# EAGLE design AntennaPCB EXTV1 (EAGLE 9.1.3)
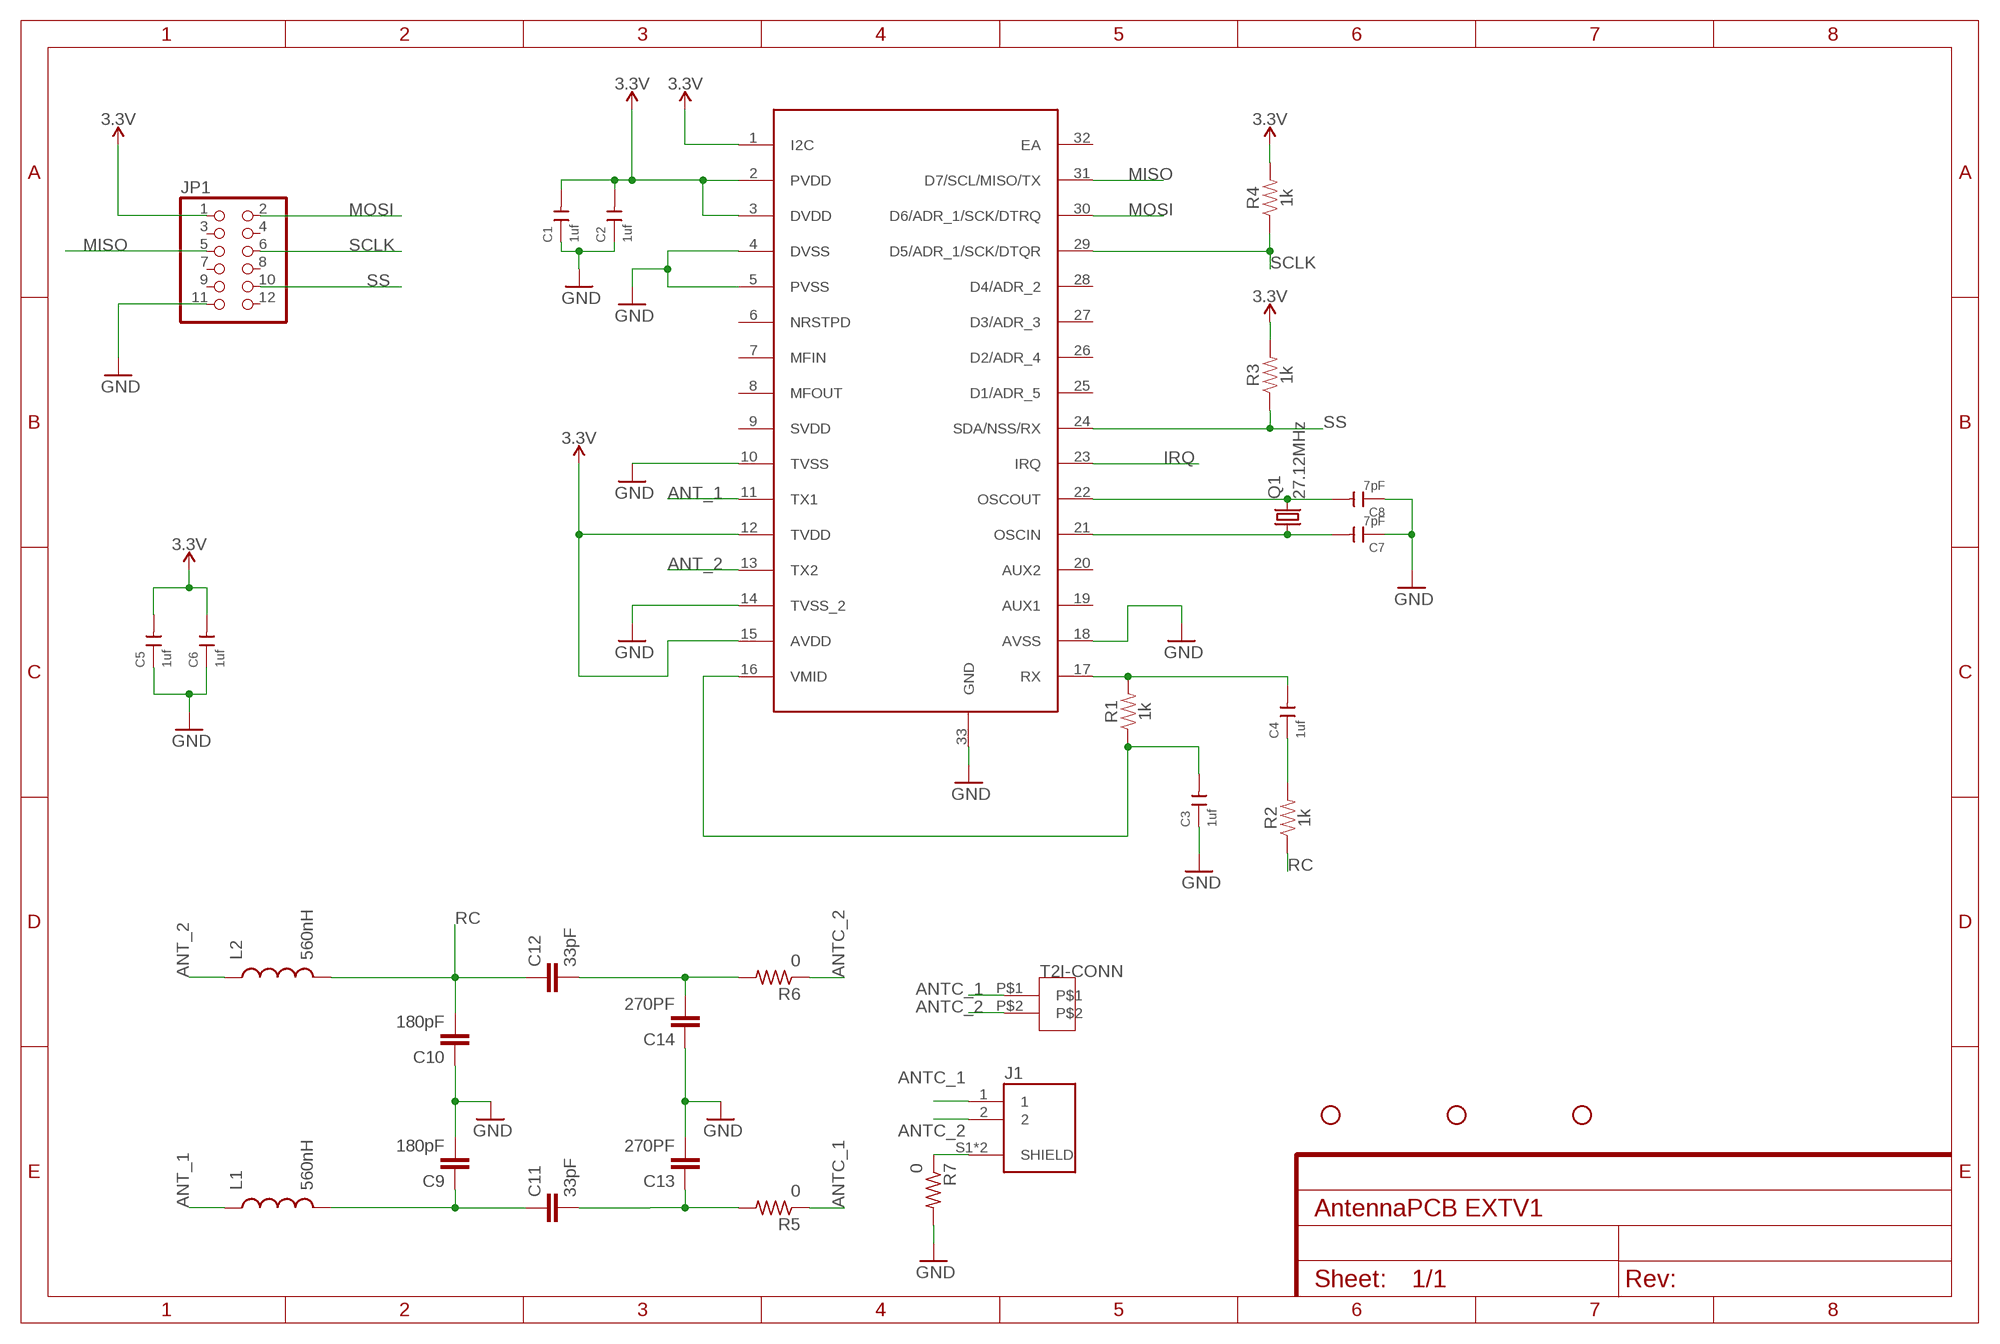
[diagram p0: schematic, sheet 1]
FRAME1 (FRAME-A4L): SPICEPREFIX: X

## Parts
C1  1uf  CERAMIC-1UF-25V-10%-X7R(0603)  [C0603]
C2  1uf  CERAMIC-1UF-25V-10%-X7R(0603)  [C0603]
C3  1uf  CERAMIC-1UF-25V-10%-X7R(0603)  [C0603]
C4  1uf  CERAMIC-1UF-25V-10%-X7R(0603)  [C0603]
C5  1uf  CERAMIC-1UF-25V-10%-X7R(0603)  [C0603]
C6  1uf  CERAMIC-1UF-25V-10%-X7R(0603)  [C0603]
C7  7pF  CERAMIC-1UF-25V-10%-X7R(0603)  [C0603]
C8  7pF  CERAMIC-1UF-25V-10%-X7R(0603)  [C0603]
C9  180pF  180PF-0603-50V-5%  [0603]
C10  180pF  180PF-0603-50V-5%  [0603]
C11  33pF  33PF-0603-50V-5%  [0603]
C12  33pF  33PF-0603-50V-5%  [0603]
C13  270PF  270PF-0603-50V-5%  [0603]
C14  270PF  270PF-0603-50V-5%  [0603]
H1  STAND-OFF  [STAND-OFF]
H2  STAND-OFF  [STAND-OFF]
H3  STAND-OFF  [STAND-OFF]
J1  BM02B-ACHSS-GAN-TF(LF)(SN)  [JST_BM02B-ACHSS-GAN-TF(LF)(SN)]
JP1  PINHD-2X6  [2X06]
L1  560nH  INDUCTOR  [L0603]
L2  560nH  INDUCTOR  [L0603]
Q1  27.12MHz  CRYSTALHC49S  [HC49/S]
R1  1k  1KOHM-0603-1/10W-1%  [0603]
R2  1k  1KOHM-0603-1/10W-1%  [0603]
R3  1k  1KOHM-0603-1/10W-1%  [0603]
R4  1k  1KOHM-0603-1/10W-1%  [0603]
R5  0  ERJ-8GEY0R00V  [RES_1206]
R6  0  ERJ-8GEY0R00V  [RES_1206]
R7  0  ERJ-8GEY0R00V  [RES_1206]
U$1  MFRC522  [HVQFN32]
U$2  T2I-02  [T2I-02]

## Nets
3.3V: C1.2 C2.2 C5.2 C6.2 JP1.1 R3.2 R4.2 U$1.1(I2C) U$1.2(PVDD) U$1.3(DVDD) U$1.12(TVDD) U$1.15(AVDD)
ANT_1: L1.1 U$1.11(TX1)
ANT_2: L2.1 U$1.13(TX2)
ANTC_1: J1.1 R5.1 U$2.P$1
ANTC_2: J1.2 R6.1 U$2.P$2
GND: C1.1 C2.1 C3.1 C5.1 C6.1 C7.1 C8.1 C9.2 C10.1 C13.2 C14.1 JP1.11 R7.2 U$1.4(DVSS) U$1.5(PVSS) U$1.10(TVSS) U$1.14(TVSS_2) U$1.18(AVSS) U$1.33(GND)
IRQ: U$1.23(IRQ)
MISO: JP1.5 U$1.31(D7/SCL/MISO/TX)
MOSI: JP1.2 U$1.30(D6/ADR_1/SCK/DTRQ)
N$1: C3.2 R1.1 U$1.16(VMID)
N$2: C4.2 R1.2 U$1.17(RX)
N$3: C4.1 R2.2
N$5: C8.2 Q1.2 U$1.22(OSCOUT)
N$6: C7.2 Q1.1 U$1.21(OSCIN)
N$7: J1.S1(SHIELD) J1.S2(SHIELD) R7.1
N$9: C9.1 C11.1 L1.2
N$10: C11.2 C13.1 R5.2
N$11: C12.2 C14.2 R6.2
RC: C10.2 C12.1 L2.2 R2.1
SCLK: JP1.6 R4.1 U$1.29(D5/ADR_1/SCK/DTQR)
SS: JP1.10 R3.1 U$1.24(SDA/NSS/RX)
Unconnected: JP1.3 JP1.4 JP1.7 JP1.8 JP1.9 JP1.12 U$1.6(NRSTPD) U$1.7(MFIN) U$1.8(MFOUT) U$1.9(SVDD) U$1.19(AUX1) U$1.20(AUX2) U$1.25(D1/ADR_5) U$1.26(D2/ADR_4) U$1.27(D3/ADR_3) U$1.28(D4/ADR_2) U$1.32(EA)

## Library data of the parts
C1-C6 = Seeed-Capacitor:CERAMIC-1UF-25V-10%-X7R(0603): 302010139; MPN: CC0603KRX7R8BB105
C7 C8 = Seeed-Capacitor:CERAMIC-1UF-25V-10%-X7R(0603): 302010139; MPN: CC0603KRX7R8BB105; VALUE: 1uf
C9 C10 = SparkFun-Capacitors:180PF: 180pF/0.18nF ceramic capacitors A capacitor is a passive two-terminal electrical component used to store electrical energy temporarily in an electric field.; PROD_ID: CAP-11661
C11 C12 = SparkFun-Capacitors:33PF: 33pF ceramic capacitors A capacitor is a passive two-terminal electrical component used to store electrical energy temporarily in an electric field.; PROD_ID: CAP-10142
C13 C14 = SparkFun-Capacitors:270PF: 270pF/0.27nF ceramic capacitors A capacitor is a passive two-terminal electrical component used to store electrical energy temporarily in an electric field.; PROD_ID: CAP-13339
H1-H3 = SparkFun-Hardware:STAND-OFF: Stand Off Drill holes for mechanically mounting via screws, standoffs, etc. Note: Use the keepout ring to avoid running the screw head into surrounding components. Variant Overviews STAND-OFF - Mechanical footprint for a #4 phillips button head screw. STAND-OFF-TIGHT - Mechanical footprint for a #4 phillips button head screw, Example SparkFun Products Screw - Phillips Head (1/4", 4-40, 10 pack) <https://www.sparkfun.com/products/10453> (PRT-10453) Screw - Phillips Head (1/2", 4-40, 10 pack) <https://www.sparkfun.com/products/10452> (PRT-10452) Screw - Phillips Head (3/4", 4-40, 10 pack) <https://www.sparkfun.com/products/10451> (PRT-10451) Screw - Phillips Head (1", 4-40, 10 pack) <https://www.sparkfun.com/products/10450> (PRT-10450)
J1 = BM02B-ACHSS-GAN-TF_LF__SN_:BM02B-ACHSS-GAN-TF(LF)(SN): BM02B Series 1.2 mm Pitch UltraThin Low Profile Compact Shrouded Header; AVAILABILITY: Unavailable; DESCRIPTION: Connector Header Surface Mount, Right Angle 2 position 0.047 _1.20mm_; MF: JST Sales; MP: BM02B-ACHSS-GAN-TF_LF__SN_; PACKAGE: None; PRICE: None
JP1 = pinhead:PINHD-2X6: PIN HEADER
L1 L2 = BeagleBone_Blue_R3:INDUCTOR: Inductors Basic Inductor/Choke - 0603 and 1206. Footprints are not proven and vary greatly between part numbers. SRN6045- 33uH, 20% 1.4A
Q1 = crystal:CRYSTAL: CRYSTAL; OC_FARNELL: 1667008; OC_NEWARK: unknown
R1-R4 = SparkFun-Resistors:1KOHM: 1kΩ resistor A resistor is a passive two-terminal electrical component that implements electrical resistance as a circuit element. Resistors act to reduce current flow, and, at the same time, act to lower voltage levels within circuits. - Wikipedia; PROD_ID: RES-07856
R5-R7 = Resistor_Capacitor:ERJ-8GEY0R00V: RES SMD 0 OHM JUMPER 1/4W 1206 Manufacturer's datasheet <https://industrial.panasonic.com/ww/products/resistors/chip-resistors/general-purpose-chip-resistors/thick-film-chip-resistors/ERJ8GEY0R00V>; CREATED_BY: PCBLayout.com; DIGIKEY_PART_NUMBER: P0.0ETR-ND; MANUFACTURER: Panasonic Electronic Components; MPN: ERJ-8GEY0R00V; PACKAGE: SMD 1206
U$1 = SeniorDesignParts:MFRC522
U$2 = SeniorDesignParts:T2I-02

## Board
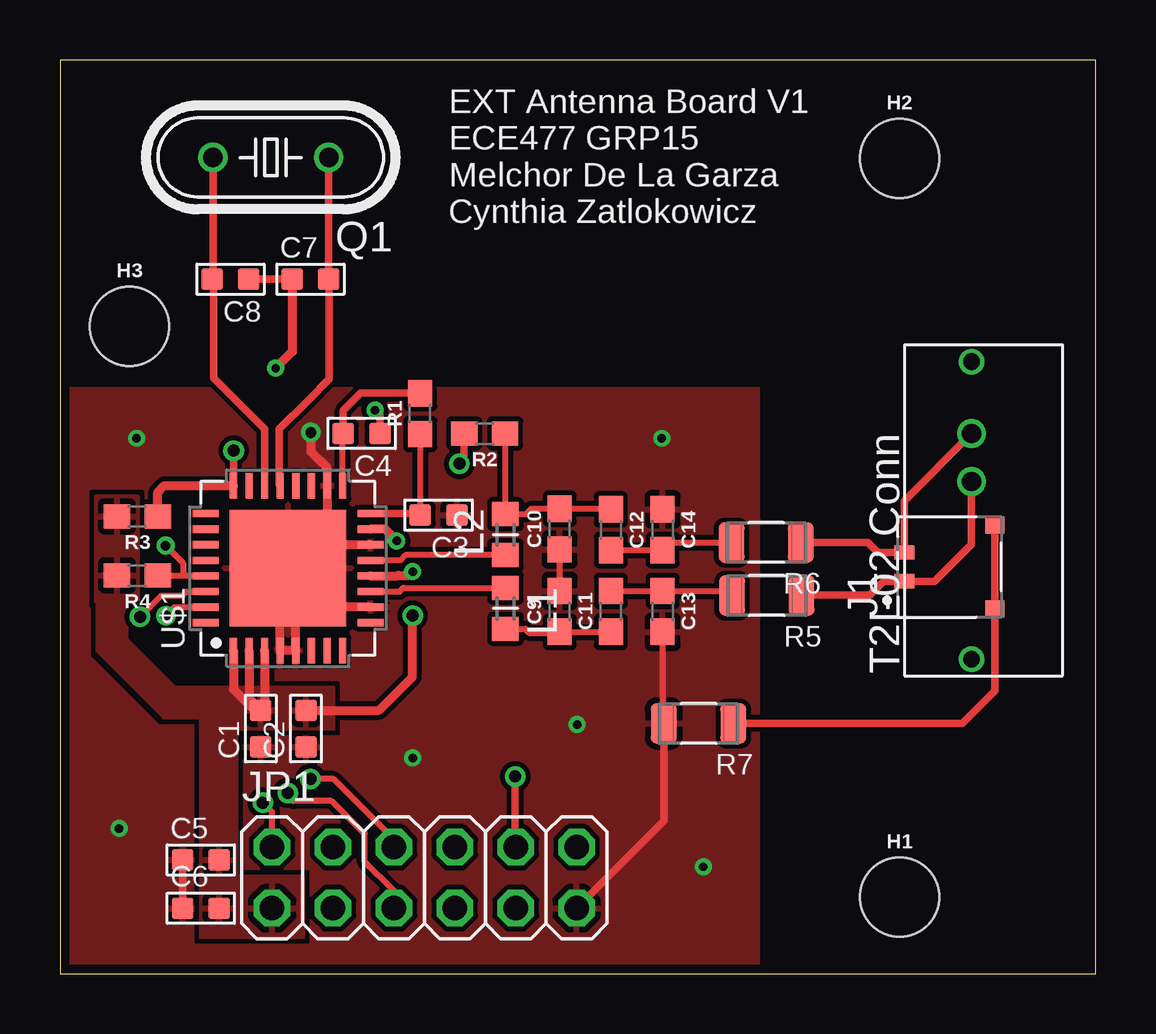
[diagram p1: board, top side]
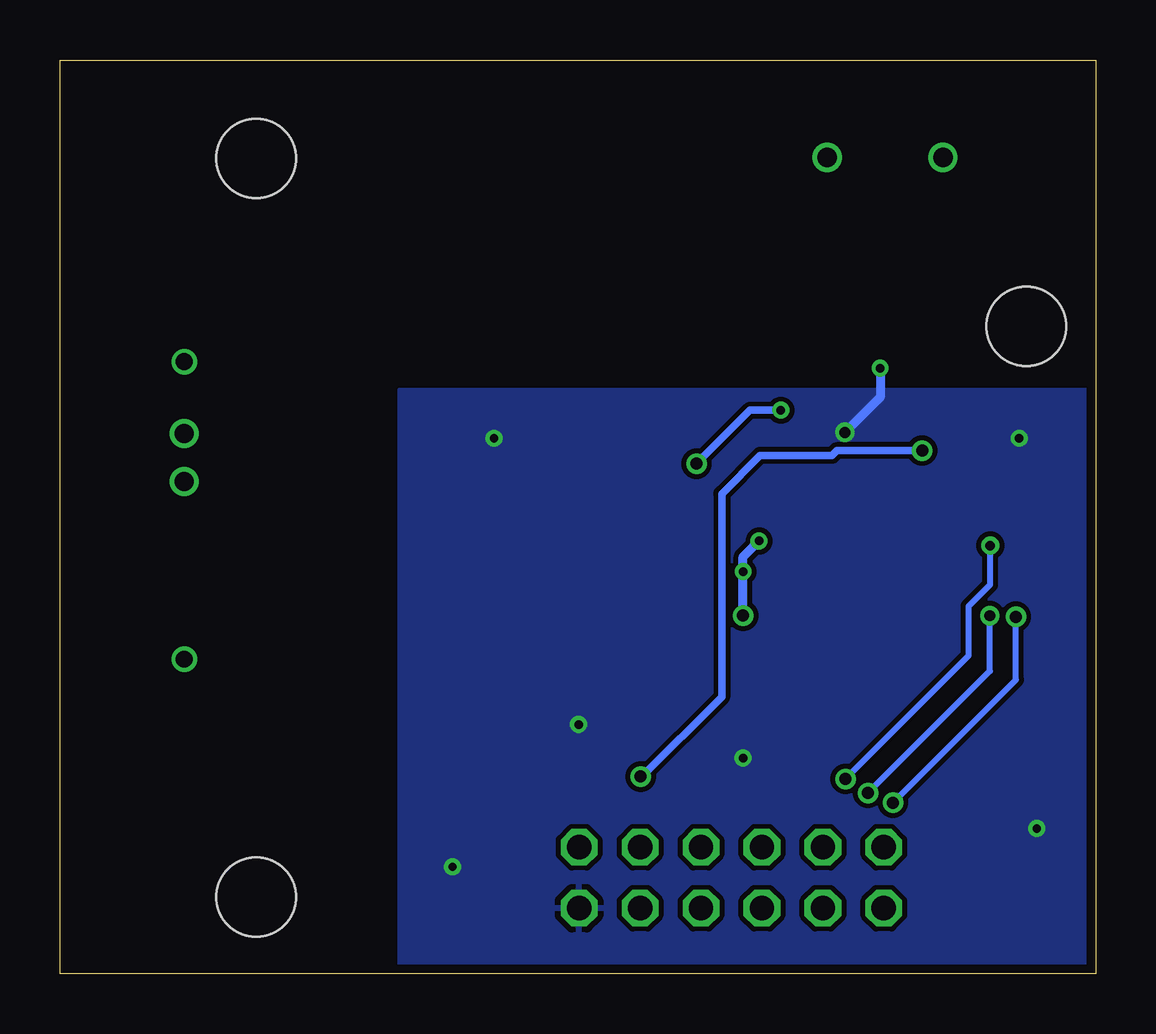
[diagram p2: board, bottom side, seen from below]

Size 43.18 x 38.1 mm. Coordinates in mm from the lower left corner, seen from the top.
Outline: 0,0 43.18,0 43.18,38.1 0,38.1 0,0
Copper layers (1*16): Top 0.0356mm / dielectric 1.5011mm / Bottom 0.0356mm
Design rules "ECE_Senior_Design": minimum track width 8mil, minimum drill 13mil, track to track 8mil, track to pad 8mil, pad to pad 6mil, via to via 8mil, smd to smd 6mil, copper to edge 15mil, drill to drill 8mil, minimum pad ring 7mil, minimum via ring 7mil, stop-mask expansion 3mil, vias tented up to drill 0mil, thermal gap 10mil

### Footprints (pad centres in the part's own frame; a part is rotated, then mirrored left to right if it is on the bottom)
C0603 = smd 0.889 x 0.889: 1 0,0.762; 2 0,-0.762
0603 = smd 1.1 x 1: 1 -0.85,0; 2 0.85,0
STAND-OFF = hole 3.302: 0,0
JST_BM02B-ACHSS-GAN-TF(LF)(SN) = smd 0.6 x 0.85: 1 -0.6,1.887; 2 0.6,1.887 | smd 0.7 x 0.8: S1 -1.75,-1.887; S2 1.75,-1.887
2X06 = drill 1.016 octagon: 1 -6.35,-1.27; 2 -6.35,1.27; 3 -3.81,-1.27; 4 -3.81,1.27; 5 -1.27,-1.27; 6 -1.27,1.27; 7 1.27,-1.27; 8 1.27,1.27; 9 3.81,-1.27; 10 3.81,1.27; 11 6.35,-1.27; 12 6.35,1.27
L0603 = smd 1 x 1.1: 1 -0.85,0; 2 0.85,0
HC49/S = drill 0.813: 1 -2.413,0; 2 2.413,0
RES_1206 = smd 1.08 x 1.68: 1 -1.445,0; 2 1.445,0
HVQFN32 = smd 1.075 x 0.3: 1 -0.263,5.45; 2 -0.263,4.8; 3 -0.263,4.15; 4 -0.263,3.5; 5 -0.263,2.85; 6 -0.263,2.2; 7 -0.263,1.55; 8 -0.263,0.9; 17 6.612,0.9; 18 6.612,1.55; 19 6.612,2.2; 20 6.612,2.85; 21 6.612,3.5; 22 6.612,4.15; 23 6.612,4.8; 24 6.612,5.45 | smd 0.3 x 1.075: 9 0.9,-0.263; 10 1.55,-0.263; 11 2.2,-0.263; 12 2.85,-0.263; 13 3.5,-0.263; 14 4.15,-0.263; 15 4.8,-0.263; 16 5.45,-0.263; 25 5.45,6.612; 26 4.8,6.612; 27 4.15,6.612; 28 3.5,6.612; 29 2.85,6.612; 30 2.2,6.612; 31 1.55,6.612; 32 0.9,6.612 | smd 4.85 x 4.85: 33 3.175,3.175
T2I-02 = drill 0.8: P$1 0,0; P$2 2,0 | drill 0.7: P$3 -7.4,0; P$4 5,0

### Placement (x,y rotation side)
C1  8.37,10.23 180 top
C2  10.26,10.23 180 top
C3  15.78,19.13 270 top
C4  12.57,22.53 270 top
C5  5.87,4.75 90 top
C6  5.87,2.74 90 top
C7  10.44,28.96 90 top
C8  7.11,28.96 270 top
C9  20.83,15.11 90 top
C10  20.83,18.54 90 top
C11  22.96,15.11 90 top
C12  22.96,18.52 270 top
C13  25.12,15.11 270 top
C14  25.12,18.52 270 top
H1  35,3.2 0 top
H2  35,34 0 top
H3  2.9,27 0 top
J1  37.08,16.97 90 top
JP1  15.19,4.01 0 top
L1  18.57,15.24 270 top
L2  18.57,18.31 90 top
Q1  8.79,34.04 180 top
R1  15.01,23.36 90 top
R2  17.7,22.53 180 top
R3  3.23,19.08 180 top
R4  3.23,16.61 180 top
R5  29.46,15.77 180 top
R6  29.44,17.98 180 top
R7  26.62,10.44 180 top
U$1  12.68,13.74 90 top
U$2  38,20.52 90 top

### Tracks (layer width: path | path; a pad name or v marks a point on that pad's centre or on a via)
3.3V  (via drill 0.35, 0.5)
  Top 0.381: U$1.1 7.23,11.87 8.11,10.99 C1.2 | U$1.2 7.88,11.48 C1.2 | U$1.3 8.53,11.15 C1.2 | C2.2 13.3,10.99 14.69,12.38 14.69,14.93 v14.7,14.94 | v14.04,18.05 13.55,18.54 U$1.15 | U$1.12 14.08,16.59 14.1,16.61 14.54,16.61 v14.7,16.77
  Bottom 0.381: v14.7,14.94 v14.7,16.77 14.7,17.39 v14.04,18.05
  pour Top: 10.16,4.06 7.39,4.06 7.39,11.94 5.84,11.94 5.84,1.52 10.16,1.52
  pour Top: 7.11,10.92 7.11,10.21 11.43,10.21 11.43,11.94 11.18,11.94 7.11,11.94
  pour Top: 2.16,19.94 3.25,19.94 3.25,15.49 1.5,15.49 1.5,19.94
  pour Top: 1.52,17.27 1.52,13.46 4.32,10.67 7.62,10.67 7.62,11.94 4.83,11.94 2.79,13.97 2.79,17.27
ANT_1
  Top 0.254: U$1.11 14.16,15.94 14.31,16.09 L1.1
ANT_2
  Top 0.254: L2.1 14.41,17.46 14.19,17.24 U$1.13
ANTC_1
  Top 0.305: U$2.P$1 38,17.91 36.45,16.36 35.21,16.36 J1.1 34.33,16.37 33.76,15.8 30.93,15.8 R5.1
ANTC_2
  Top 0.305: U$2.P$2 35.2,19.72 J1.2 34.1,17.57 33.68,17.98 R6.1
GND  (via drill 0.35, 0.45)
  Top 0.254: C10.1 C9.2 | C13.2 25.12,10.49 R7.2
  Top 0.305: C7.1 C8.1 | R7.2 25.17,6.38 JP1.11 | C5.1 C6.1
  Top 0.381: C7.1 9.68,25.93 v8.99,25.25 | v10.46,22.57 10.46,21.77 11.13,21.1 U$1.18 11.13,18.54 10.48,17.89 | 9.83,16.59 U$1.5 U$1.4 9.18,16.59 U$1.33 | 9.83,16.59 U$1.33 | U$1.10 11.13,15.29 9.83,16.59 | U$1.14 10.48,17.89 | 10.48,17.89 U$1.33
  Bottom 0.381: v8.99,25.25 8.99,24.04 v10.46,22.57
  other vias: 3.2,22.33 25.09,22.33 21.56,10.4 26.82,4.47 14.71,9 2.46,6.07
  pour Top (rank 2): 0,0 29.11,0 29.11,24.41 0,24.41
  pour Bottom (rank 2): 29.05,-0.05 -0.02,-0.05 -0.02,24.36 29.05,24.36
MISO  (via drill 0.45, 0.5)
  Top 0.254: JP1.5 13.92,3.45 12.7,4.67 12.7,5.84 | v4.42,14.94 4.77,15.29 U$1.31 | 12.7,5.84 | 12.7,5.84 | 12.7,5.84 11.33,7.21 9.73,7.21 9.5,7.44 v9.5,7.54
  Bottom 0.254: v9.5,7.54 4.42,12.63 v4.42,14.94
MOSI  (via drill 0.5)
  Top 0.254: JP1.2 8.84,6.76 v8.46,7.14 | v3.33,14.89 4.22,15.77 5.11,15.77 5.27,15.94 U$1.30
  Bottom 0.254: v8.46,7.14 3.33,12.26 v3.33,14.89
N$1
  Top 0.254: R1.1 C3.2
  Top 0.305: U$1.16 14.96,19.19 C3.2
N$2
  Top 0.254: U$1.17 11.78,22.53 C4.2
  Top 0.305: C4.2 11.81,23.48 12.54,24.21 R1.2
N$3  (via drill 0.35, 0.5)
  Top 0.305: R2.2 16.85,21.48 v16.65,21.27 | v13.13,23.5 13.34,23.3 C4.1
  Bottom 0.305: v16.65,21.27 14.42,23.5 v13.13,23.5
N$5
  Top 0.305: Q1.2 6.38,28.98 C8.2 6.4,28.91 6.4,24.84 8.53,22.71 U$1.22
N$6
  Top 0.305: Q1.1 C7.2 11.23,28.93 11.23,24.79 10.36,23.92 9.14,22.71 9.14,20.39 U$1.21
N$7
  Top 0.305: R7.1 37.62,10.44 38.97,11.79 J1.S1 J1.S2
N$9
  Top 0.254: L1.2 19.39,14.39 19.56,14.22 20.79,14.22 C9.1 C11.1
N$10
  Top 0.254: C11.2 C13.1 27.83,15.96 R5.2
N$11
  Top 0.254: C12.2 C14.2 25.44,17.98 R6.2
RC
  Top 0.254: R2.1 18.55,19.18 L2.2 19.42,19.16 19.65,19.39 C10.2 22.94,19.39 C12.1
SCLK  (via drill 0.4, 0.5)
  Top 0.254: 5.13,16.61 5.23,16.61 6.05,16.61 U$1.29 | JP1.6 13.92,5.61 11.4,8.13 v10.44,8.13 | v4.4,17.86 5.13,17.13 5.13,16.61 | R4.1 5.13,16.61
  Bottom 0.254: v4.4,17.86 4.4,16.23 5.3,15.34 5.3,13.27 v10.44,8.13
SS  (via drill 0.5)
  Top 0.305: U$1.24 7.23,21.81 v7.24,21.82 | v18.97,8.23 18.97,5.31 JP1.10
  Top 0.381: R3.1 4.08,20.08 4.35,20.35 U$1.24
  Bottom 0.305: v7.24,21.82 10.8,21.82 11,21.61 13.99,21.61 15.6,20.02 15.6,11.56 18.97,8.18 v18.97,8.23

### Text on the board
tPlace: EXT Antenna Board V1 / ECE477 GRP15 / Melchor De La Garza / Cynthia Zatlokowicz